# EAGLE design kurauduino (EAGLE 7.2.0)
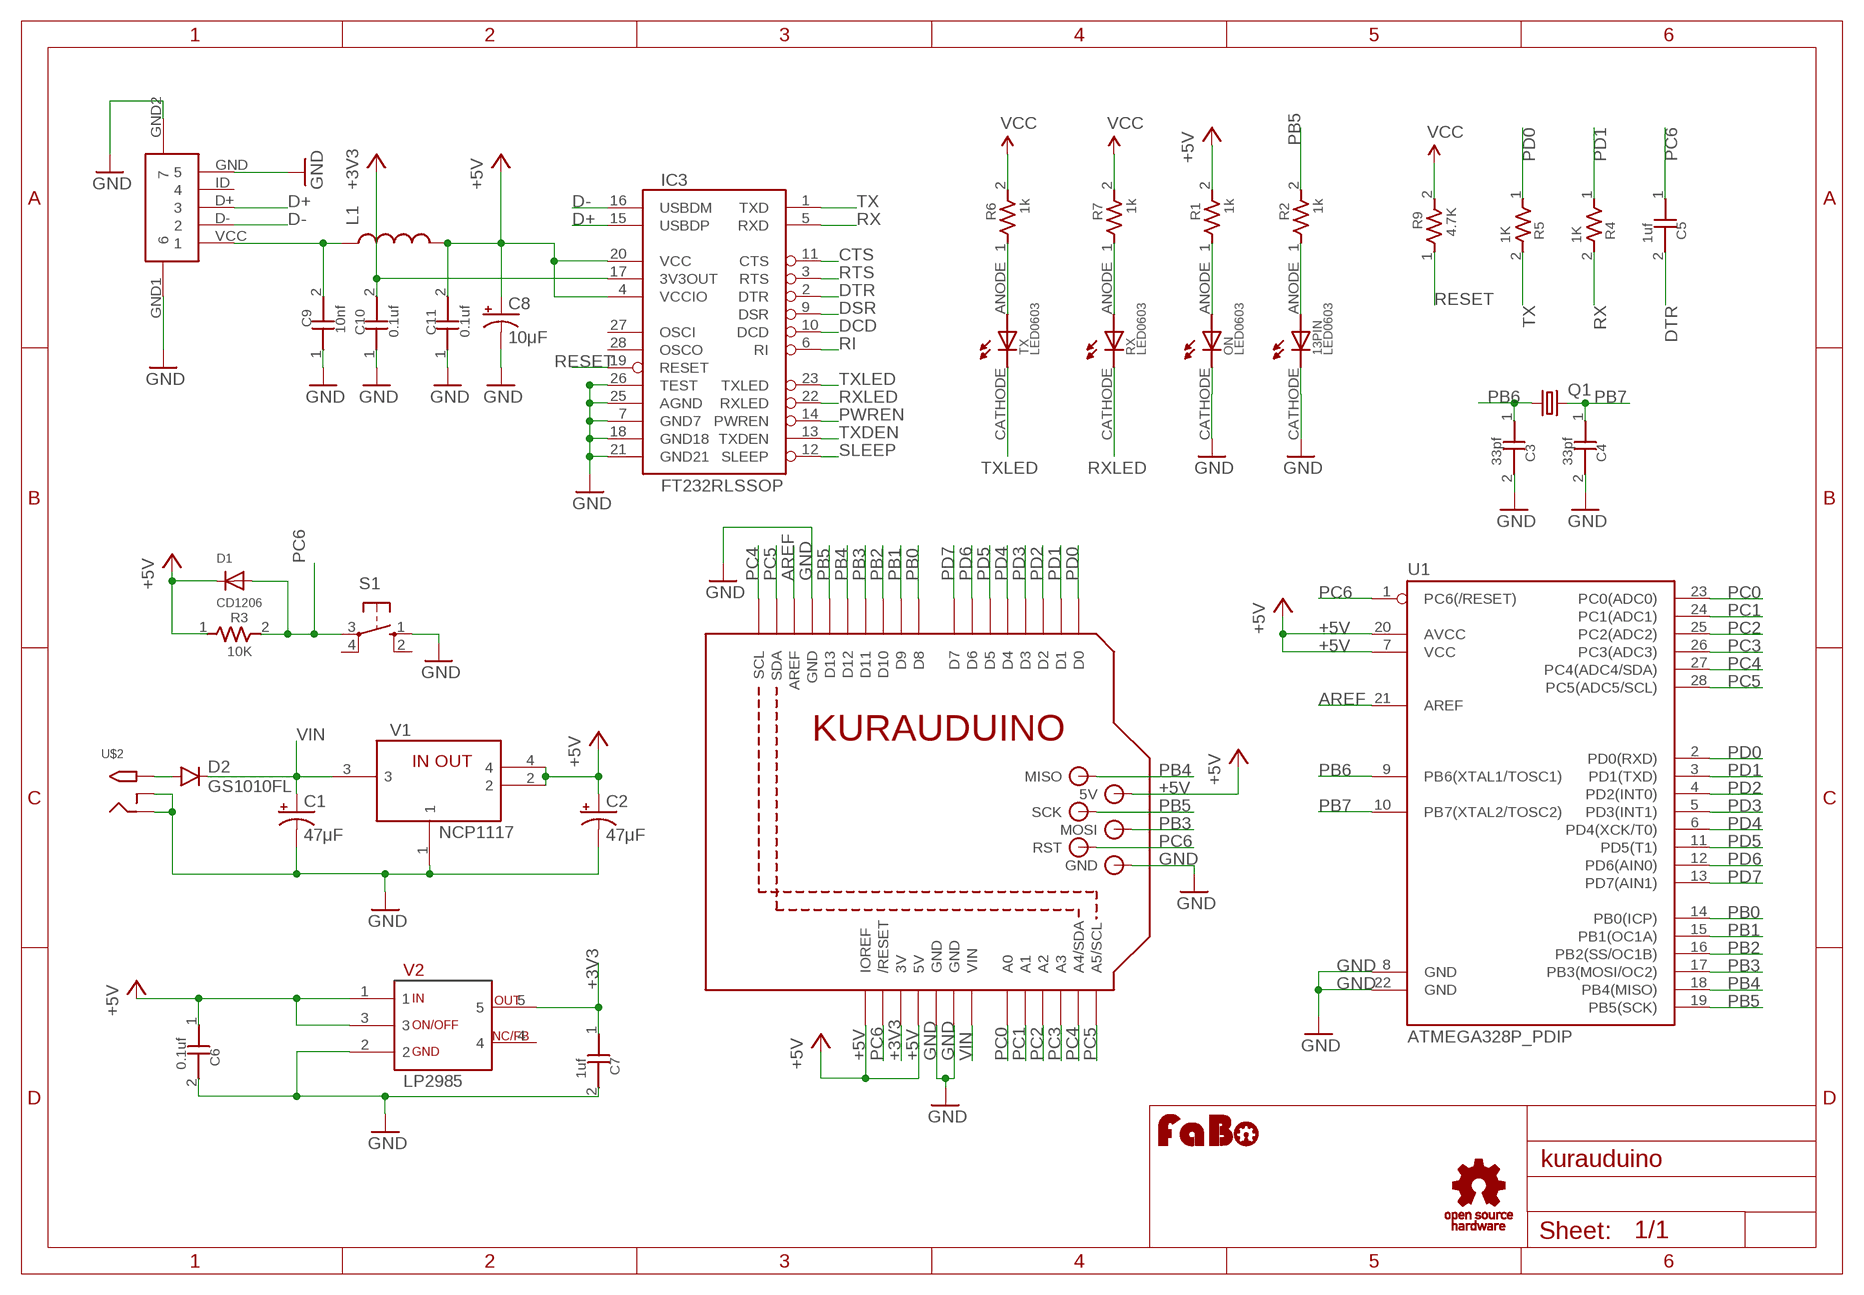
[diagram p0: schematic, sheet 1]

## Parts
13PIN  LED0603  [0603]
C1  47μF  CPOL-USD  [PANASONIC_D]
C2  47μF  CPOL-USD  [PANASONIC_D]
C3  33pf  CAPACITOR0603  [0603]
C4  33pf  CAPACITOR0603  [0603]
C5  1uf  CAPACITOR0603  [0603]
C6  0.1uf  CAPACITOR0603  [0603]
C7  1uf  CAPACITOR0603  [0603]
C8  10μF  CAP_POL1206  [EIA3216]
C9  10nf  CAPACITOR0603  [0603]
C10  0.1uf  CAPACITOR0603  [0603]
C11  0.1uf  CAPACITOR0603  [0603]
D1  CD1206  [CD1206]
D2  GS1010FL  DIODESOD123  [SOD-123]
IC3  FT232RLSSOP  [SSOP28DB]
L1  INDUCTOR0603  [0603]
ON  LED0603  [0603]
Q1  CRYSTALHC49S  [HC49/S]
R1  1k  RESISTOR0603  [0603]
R2  1k  RESISTOR0603  [0603]
R3  10K  RESISTOR0603  [0603]
R4  1K  RESISTOR0603  [0603]
R5  1K  RESISTOR0603  [0603]
R6  1k  RESISTOR0603  [0603]
R7  1k  RESISTOR0603  [0603]
R9  4.7K  RESISTOR0603  [0603]
RX  LED0603  [0603]
S1  10-XX  [B3F-10XX]
TX  LED0603  [0603]
U1  ATMEGA328P_PDIP  [DIL28-3]
U$1  KURAUDUINO  [KURAUDUINO]
U$2  2.1MMJACKTHM  [PJ-102A]
U$3  USB-MICRO-B-FEMALE  [USB-MICRO-B-FEMALE]
U$4  LOGO_FABO-M  [LOGO_FABO_M]
U$5  LOGO_OSHW_T-S  [LOGO_OSHW_T_S]
V1  NCP1117  [NCP1117]
V2  LP2985  [LP2985]

## Nets
+3V3 [power2]: C7.1 C10.2 IC3.17(3V3OUT) U$1.3V V2.5
+5V [power2]: C2.+ C6.1 C8.A(+) C11.2 D1.K IC3.4(VCCIO) IC3.20(VCC) L1.2 R1.2 R3.1 U1.7(VCC) U1.20(AVCC) U$1.5V U$1.5V_ICSP(5V) U$1.IOREF V1.2 V1.4 V2.1 V2.3
AREF [aref]: U1.21(AREF) U$1.AREF
CTS: IC3.11(CTS)
D+: IC3.15(USBDP) U$3.D+
D-: IC3.16(USBDM) U$3.D-
DCD: IC3.10(DCD)
DSR: IC3.9(DSR)
DTR: C5.2 IC3.2(DTR)
GND [gnd]: C1.- C2.- C3.2 C4.2 C6.2 C7.2 C8.C(-) C9.1 C10.1 C11.1 IC3.7(GND7) IC3.18(GND18) IC3.21(GND21) IC3.25(AGND) IC3.26(TEST) S1.1(S) U1.8(GND) U1.22(GND) U$1.GND U$1.GND1(GND) U$1.GND2(GND) U$1.GND@3(GND) U$2.RING U$2.RING_SW U$3.GND U$3.GND1 U$3.GND2 V1.1 V2.2
N$1 [power]: D2.A U$2.TIP
N$2: C9.2 L1.1 U$3.VCC
N$3: R6.1 TX.ANODE
N$4: ON.CATHODE
N$5: 13PIN.CATHODE
N$6: R7.1 RX.ANODE
N$7 [power2]: ON.ANODE R1.1
N$8: 13PIN.ANODE R2.1
PB0: U1.14(PB0(ICP)) U$1.D8
PB1: U1.15(PB1(OC1A)) U$1.D9
PB2: U1.16(PB2(SS/OC1B)) U$1.D10
PB3: U1.17(PB3(MOSI/OC2)) U$1.D11 U$1.MOSI
PB4: U1.18(PB4(MISO)) U$1.D12 U$1.MISO
PB5: R2.2 U1.19(PB5(SCK)) U$1.D13 U$1.SCK
PB6: C3.1 Q1.1 U1.9(PB6(XTAL1/TOSC1))
PB7: C4.1 Q1.2 U1.10(PB7(XTAL2/TOSC2))
PC0: U1.23(PC0(ADC0)) U$1.A0
PC1: U1.24(PC1(ADC1)) U$1.A1
PC2: U1.25(PC2(ADC2)) U$1.A2
PC3: U1.26(PC3(ADC3)) U$1.A3
PC4: U1.27(PC4(ADC4/SDA)) U$1.A4(A4/SDA) U$1.SCL
PC5: U1.28(PC5(ADC5/SCL)) U$1.A5(A5/SCL) U$1.SDA
PC6: C5.1 D1.A R3.2 S1.3(P) U1.1(PC6(/RESET)) U$1.RESET(/RESET) U$1.RESET_ICSP(RST)
PD0: R5.1 U1.2(PD0(RXD)) U$1.D0
PD1: R4.1 U1.3(PD1(TXD)) U$1.D1
PD2: U1.4(PD2(INT0)) U$1.D2
PD3: U1.5(PD3(INT1)) U$1.D3
PD4: U1.6(PD4(XCK/T0)) U$1.D4
PD5: U1.11(PD5(T1)) U$1.D5
PD6: U1.12(PD6(AIN0)) U$1.D6
PD7: U1.13(PD7(AIN1)) U$1.D7
PWREN: IC3.14(PWREN)
RESET: IC3.19(RESET) R9.1
RI: IC3.6(RI)
RTS: IC3.3(RTS)
RX: IC3.5(RXD) R4.2
RXLED: IC3.22(RXLED) RX.CATHODE
SLEEP: IC3.12(SLEEP)
TX: IC3.1(TXD) R5.2
TXDEN: IC3.13(TXDEN)
TXLED: IC3.23(TXLED) TX.CATHODE
VCC [usbvcc]: R6.2 R7.2 R9.2
VIN [power]: C1.+ D2.C U$1.VIN V1.3
Unconnected: IC3.27(OSCI) IC3.28(OSCO) S1.2(S1) S1.4(P1) U$3.ID V2.4

## Library data of the parts
13PIN ON RX TX = GClue-LED:LED
C1 C2 = adafruit:CPOL-US: POLARIZED CAPACITOR, American symbol
C3-C7 C9-C11 = GClue-Capacitor:CAPACITOR
C8 = SparkFun:CAP_POL: Capacitor Polarized These are standard SMD and PTH capacitors. Normally 10uF, 47uF, and 100uF in electrolytic and tantalum varieties. Always verify the external diameter of the through hole cap, it varies with capacity, voltage, and manufacturer. The EIA devices should be standard.
D1 = mylib:CD1206
D2 = SparkFun-DiscreteSemi:DIODE: Diode These are standard reverse protection diodes and small signal diodes. SMA package can handle up to about 1A. SOD-323 can handle about 200mA. What the SOD-323 package when ordering, there are some mfgs out there that are 5-pin packages.
IC3 = SparkFun:FT232RL: USB UART FT232RL 4th Generation USB UART (USB <-> Serial) Controller. Spark Fun Electronics SKU : COM-00650
L1 = SparkFun:INDUCTOR: Inductors Basic Inductor/Choke - 0603 and 1206. Footprints are not proven and vary greatly between part numbers.
Q1 = adafruit:CRYSTAL: CRYSTAL; OC_FARNELL: 1667008; OC_NEWARK: unknown
R1-R7 R9 = GClue-Resistors:RESISTOR
S1 = switch-omron:10-XX: OMRON SWITCH; MPN: B3F-1000; OC_FARNELL: 176432; OC_NEWARK: 36M3542
U1 = SparkFun-DigitalIC:ATMEGA328P_PDIP: uC used in the Arduino 32kb flash, 1k EEPROM, 2k SRAM This is the through-hole version of this chip.
U$1 = GClue-Board:KURAUDUINO
U$2 = adafruit:2.1MMJACK: 2.1mm x 5.5mm THM DC jack with internal switch. Digikey part #PJ-102A, 4UCON part #05537 2.1mm x 5.5mm SMT DC jack with internal switch. Digikey part #PJ-002A-SMT, 4UCON part #03267 By microbuilder.eu & adafruit.com
U$3 = gclue:USB-MICRO-B-FEMALE
U$4 = FaBo:LOGO_FABO
U$5 = gclue:LOGO_OSHW_T
V1 = mylib:NCP1117
V2 = mylib:LP2985

## Net classes
0 default: width 0.254 mm
1 power: width 0.61 mm
2 gnd: width 0.305 mm
3 usbvcc: width 0.508 mm
4 aref: width 0.406 mm
5 power2: width 0.508 mm

## Board
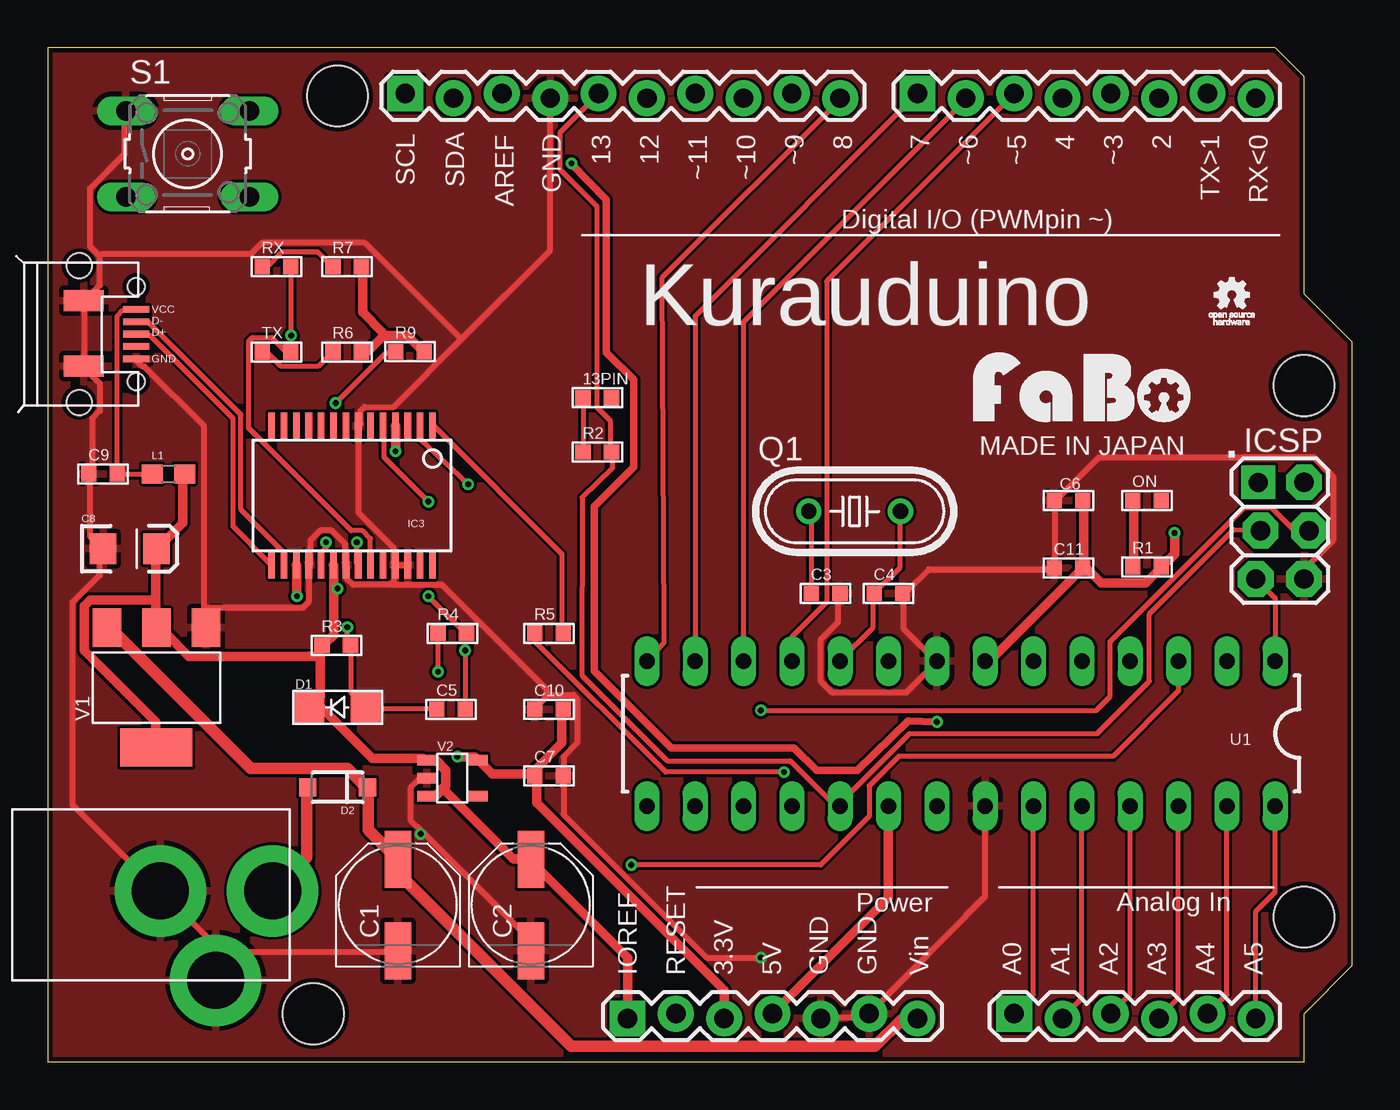
[diagram p1: board, top side]
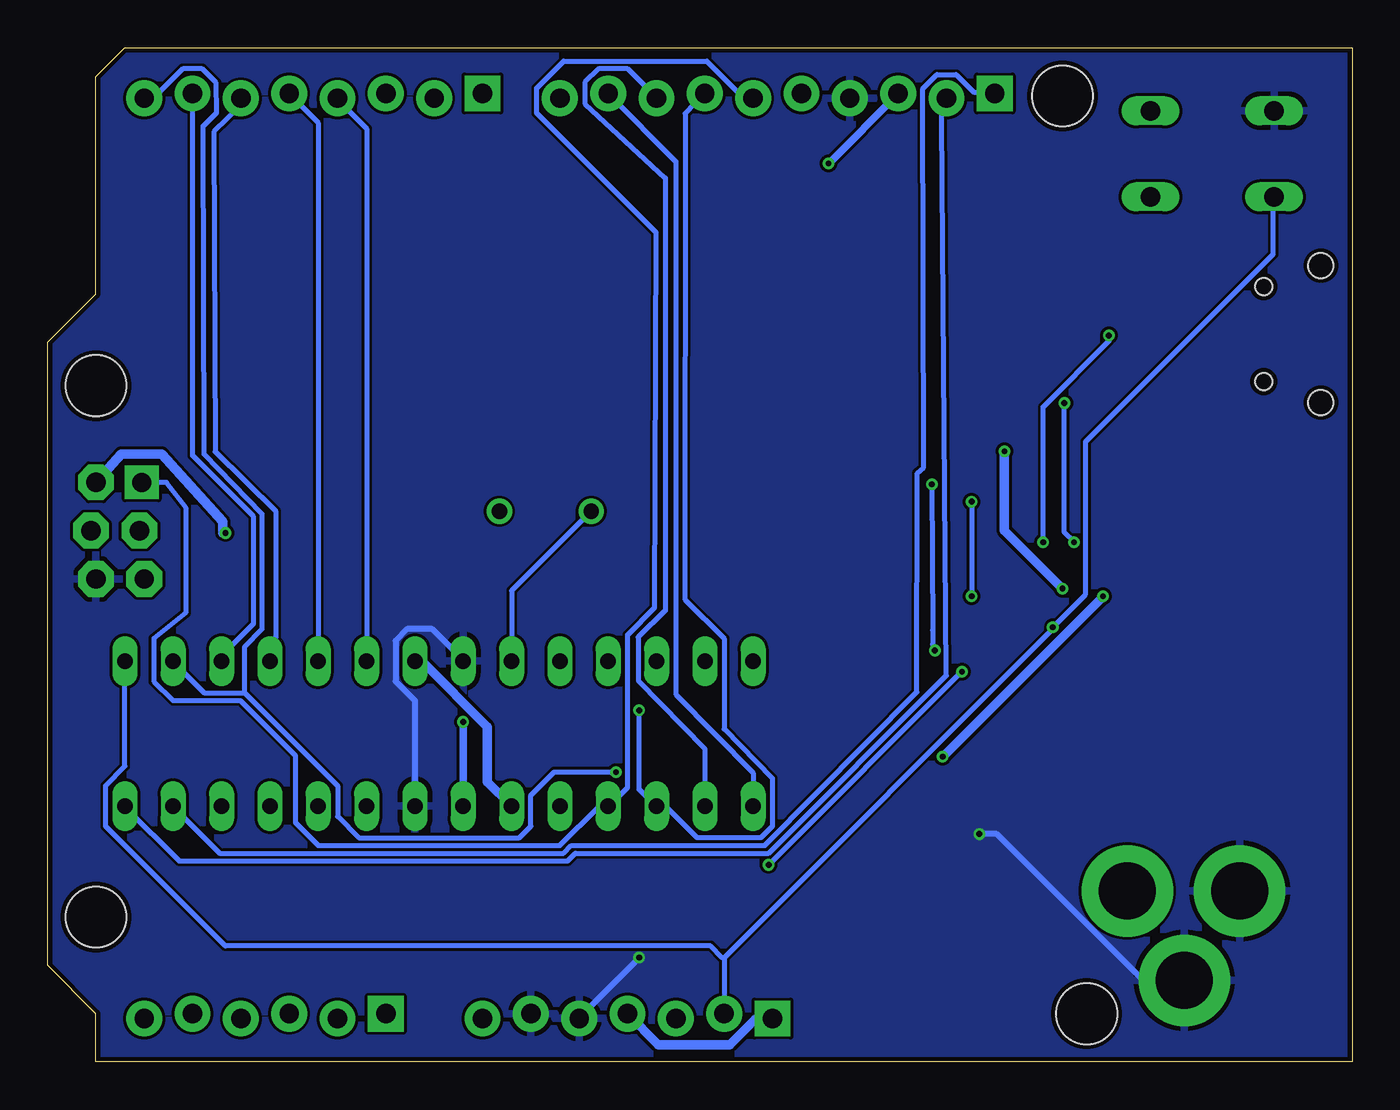
[diagram p2: board, bottom side, seen from below]

Size 68.58 x 53.34 mm. Coordinates in mm from the lower left corner, seen from the top.
Copper layers (1*16): Top 0.035mm / dielectric 1.5mm / Bottom 0.035mm
Design rules "Elecrow_2-layer_eagle_rule": minimum track width 6mil, minimum drill 12mil, track to track 6mil, track to pad 6mil, pad to pad 6mil, via to via 6mil, smd to smd 0mil, copper to edge 10mil, drill to drill 10mil, minimum pad ring 10mil, minimum via ring 6mil, stop-mask expansion 2mil, vias tented up to drill 100mil, thermal gap 10mil

### Footprints (pad centres in the part's own frame; a part is rotated, then mirrored left to right if it is on the bottom)
0603 = smd 0.8 x 0.8: ANODE -0.75,0; CATHODE 0.75,0
PANASONIC_D = smd 3 x 1.4: + 2.4,0; - -2.4,0
0603' = smd 0.8 x 0.8: 1 -0.75,0; 2 0.75,0
EIA3216 = smd 1.4 x 1.6: A 1.4,0; C -1.4,0
CD1206 = smd 1.6 x 1.6: A 1.5,0; K -1.5,0
SOD-123 = smd 0.9 x 0.95: A 1.575,0; C -1.575,0
SSOP28DB = smd 0.348 x 1.397: 1 -4.225,-3.656; 2 -3.575,-3.656; 3 -2.925,-3.656; 4 -2.275,-3.656; 5 -1.625,-3.656; 6 -0.975,-3.656; 7 -0.325,-3.656; 8 0.325,-3.656; 9 0.975,-3.656; 10 1.625,-3.656; 11 2.275,-3.656; 12 2.925,-3.656; 13 3.575,-3.656; 14 4.225,-3.656; 15 4.225,3.656; 16 3.575,3.656; 17 2.925,3.656; 18 2.275,3.656; 19 1.625,3.656; 20 0.975,3.656; 21 0.325,3.656; 22 -0.325,3.656; 23 -0.975,3.656; 24 -1.625,3.656; 25 -2.275,3.656; 26 -2.925,3.656; 27 -3.575,3.656; 28 -4.225,3.656
0603'' = smd 1.1 x 1: 1 -0.85,0; 2 0.85,0
HC49/S = drill 0.813: 1 -2.413,0; 2 2.413,0
B3F-10XX = drill 1.016 long: 1 -3.251,2.261; 2 3.251,2.261; 3 -3.251,-2.261; 4 3.251,-2.261
DIL28-3 = drill 0.813 long: 1 -16.51,-3.81; 2 -13.97,-3.81; 3 -11.43,-3.81; 4 -8.89,-3.81; 5 -6.35,-3.81; 6 -3.81,-3.81; 7 -1.27,-3.81; 8 1.27,-3.81; 9 3.81,-3.81; 10 6.35,-3.81; 11 8.89,-3.81; 12 11.43,-3.81; 13 13.97,-3.81; 14 16.51,-3.81; 15 16.51,3.81; 16 13.97,3.81; 17 11.43,3.81; 18 8.89,3.81; 19 6.35,3.81; 20 3.81,3.81; 21 1.27,3.81; 22 -1.27,3.81; 23 -3.81,3.81; 24 -6.35,3.81; 25 -8.89,3.81; 26 -11.43,3.81; 27 -13.97,3.81; 28 -16.51,3.81
KURAUDUINO = drill 1.016 pad 1.88: 3V 35.56,2.286; 5V 38.1,2.54; A1 53.34,2.286; A2 55.88,2.54; A3 58.42,2.286; A4 60.96,2.54; A5 63.5,2.286; AREF 23.876,50.927; D0 63.5,50.673; D1 60.96,50.927; D2 58.42,50.673; D3 55.88,50.927; D4 53.34,50.673; D5 50.8,50.927; D6 48.26,50.673; D8 41.656,50.673; D9 39.116,50.927; D10 36.576,50.673; D11 34.036,50.927; D12 31.496,50.673; D13 28.956,50.927; GND 26.416,50.673; GND1 43.18,2.54; GND2 40.64,2.286; RESET 33.02,2.54; SDA 21.336,50.673; VIN 45.72,2.286 | drill 1.016 pad 1.88 octagon: 5V_ICSP 66.04,30.48; GND@3 66.04,25.4; MOSI 66.294,27.94; RESET_ICSP 63.5,25.4; SCK 63.754,27.94 | drill 1.016 pad 1.88 square: A0 50.8,2.54; D7 45.72,50.927; IOREF 30.48,2.286; SCL 18.796,50.927 | drill 1 pad 1.778 square: MISO 63.627,30.48 | hole 3.2: 15.24,50.8; 66.04,35.56; 13.97,2.54; 66.04,7.62
PJ-102A = drill 3 pad 4.8: RING 0.1,-3.39; RING_SW -4.6,-6.29; TIP 0.1,-9.29
USB-MICRO-B-FEMALE = smd 1.35 x 0.35: D+ 3,0; D- 3,0.65; GND 3,-1.3; ID 3,-0.65; VCC 3,1.3 | smd 2.1 x 1.1: GND1 0.246,1.77; GND2 0.246,-1.67 | hole 1.3: 0,3.6; 0,-3.6 | hole 0.9: 3,2.5; 3,-2.5
NCP1117 = smd 2 x 1.5: 1 3.15,-2.6; 2 3.15,0; 3 3.15,2.6 | smd 2 x 3.8: 4 -3.15,0
LP2985 = smd 1 x 0.55: 1 -1.35,0.95; 2 -1.35,0; 3 -1.35,-0.95; 4 1.35,-0.95; 5 1.35,0.95

### Placement (x,y rotation side)
13PIN  28.89,34.92 0 top
C1  18.41,8.26 90 top
C2  25.4,8.26 90 top
C3  33pf  [0603']  40.89,24.64 0 top
C4  33pf  [0603']  44.2,24.64 0 top
C5  1uf  [0603']  21.21,18.54 0 top
C6  0.1uf  [0603']  53.66,29.53 180 top
C7  1uf  [0603']  26.35,15.05 0 top
C8  4.32,26.99 0 top
C9  10nf  [0603']  2.92,30.92 0 top
C10  0.1uf  [0603']  26.35,18.54 0 top
C11  0.1uf  [0603']  53.66,25.97 0 top
D1  15.24,18.65 0 top
D2  15.24,14.45 180 top
IC3  16,29.78 180 top
L1  [0603'']  6.35,30.92 0 top
ON  57.78,29.53 0 top
Q1  42.42,28.96 0 top
R1  1k  [0603']  57.78,26.04 0 top
R2  1k  [0603']  28.89,32.07 0 top
R3  10K  [0603']  15.18,21.91 0 top
R4  1K  [0603']  21.27,22.54 0 top
R5  1K  [0603']  26.35,22.54 0 top
R6  1k  [0603']  15.75,37.34 0 top
R7  1k  [0603']  15.75,41.81 0 top
R9  4.7K  [0603']  19.04,37.36 0 top
RX  12.03,41.81 0 top
S1  7.37,47.75 0 top
TX  12.03,37.34 0 top
U1  48.01,17.27 180 top
U$1  0,0 0 top
U$2  2.54,8.89 90 top
U$3  1.66,38.27 0 top
U$4  54.37,33.66 0 top
U$5  62.23,40.32 0 top
V1  5.71,19.68 90 top
V2  21.27,14.92 0 top

### Tracks (layer width: path | path; a pad name or v marks a point on that pad's centre or on a via)
+3V3  (via drill 0.3)
  Top 0.508: C7.1 25.5,15.14 23.37,15.14 22.66,15.85 V2.5 22.45,16.05 v21.54,16.05 | C10.2 27.03,18.49 27.03,16.76 25.6,15.34 C7.1 | v13.11,24.49 13.11,26.11 IC3.17 | U$1.3V 35.56,3.76 25.7,13.61 25.7,14.83 C7.1
  Bottom 0.508: v21.54,16.05 v13.11,24.49
+5V  (via drill 0.3)
  Top 0.508: C11.2 54.46,26.01 54.46,29.46 C6.1 | C11.2 54.66,25.91 55.37,25.2 57.71,25.2 58.52,26.01 R1.2 58.73,26.21 59.23,26.72 v59.23,27.81 | C11.2 54.25,25.81 49.58,21.13 49.28,21.13 U1.7 | L1.2 7.11,30.89 7.11,28.35 5.79,27.03 C8.A 5.69,26.82 5.69,24.28 | 5.69,24.28 5.69,22.86 V1.2 5.89,22.66 6.1,22.66 7.42,21.34 14.33,21.34 | 5.69,24.28 2.23,24.28 1.93,23.98 1.93,21.64 5.69,17.88 5.69,16.56 V1.4 | 20.78,14.38 20.93,14.53 20.93,15.34 20.42,15.85 20.02,15.85 V2.1 19.71,15.95 17.07,15.95 14.22,18.8 D1.K 13.82,18.69 14.33,19.2 14.33,21.34 | 20.78,14.38 20.42,14.02 20.02,14.02 V2.3 | 20.78,14.38 24.49,10.67 C2.+ 25.5,10.46 30.48,5.49 U$1.IOREF | 14.33,21.34 14.33,21.84 R3.1 14.63,22.05 15.04,22.45 15.04,24.89 | 15.04,24.89 15.04,26.11 IC3.20 | v18.29,32.11 18.29,33.43 IC3.4 | v15.24,24.89 15.04,24.89 | U1.20 44.2,8.64 U$1.5V
  Bottom 0.508: U1.20 45.48,14.73 45.48,14.92 45.47,17.63 48.87,21.03 49.28,21.03 U1.7 | U$1.5V_ICSP 64.72,31.96 62.59,31.96 59.37,28.42 59.37,27.81 v59.23,27.81 | U$1.5V 36.47,0.91 32.72,0.91 31.39,2.23 30.48,2.23 U$1.IOREF | v18.29,32.11 18.29,27.94 v15.24,24.89
AREF  (via drill 0.3)
  Top 0.406: v46.74,17.88 45.24,17.94 42.55,15.34 40.44,15.34 39.22,16.51 32.77,16.51 28.73,20.55 28.73,29.21 30.8,31.27 30.8,35.88 29.37,37.31 29.37,45.34 v27.53,47.24
  Bottom 0.406: v46.74,17.88 U1.21 | v27.53,47.24 23.88,50.9 U$1.AREF
D+
  Top 0.254: U$3.D+ 4.67,38.2 5.38,38.2 9.75,33.83 9.75,28.14 11.68,26.21 IC3.15
D-
  Top 0.254: U$3.D- 4.67,38.91 5.28,38.91 10.16,34.04 10.16,29.06 12.39,26.82 12.39,26.21 IC3.16
DTR  (via drill 0.3)
  Top 0.254: v21.95,21.64 21.95,18.59 C5.2 | v22.1,30.38 19.61,32.72 19.61,33.43 IC3.2
  Bottom 0.254: v22.1,30.38 22.07,22.7 22.07,21.96 v21.95,21.64
GND  (via drill 0.3)
  Top 0.305: 2.74,42.37 2.23,42.88 2.23,45.92 4.06,47.75 4.06,49.99 S1.1 | 2.74,42.37 2.74,40.84 2.03,40.13 U$3.GND1 1.93,40.03 1.93,36.68 U$3.GND2 1.93,36.47 2.74,35.66 2.74,34.24 2.34,33.83 2.34,30.99 C9.1 2.23,30.89 2.23,27.64 2.85,27.03 C8.C 2.74,26.92 2.74,25.6 1.32,24.18 1.32,13.51 5.79,9.04 U$2.RING 5.99,8.94 9.65,5.28 U$2.RING_SW 8.84,4.37 10.26,5.79 18.39,5.79 C1.- | 19.71,12.09 25.4,6.4 C2.- | 19.71,12.09 19.1,12.7 19.1,14.43 19.51,14.83 19.91,14.83 V2.2 | v19.61,11.99 19.71,12.09 | U1.22 49.28,8.71 U$1.GND1 42.98,2.34 40.64,2.34 U$1.GND2 | C3.2 41.55,24.59 41.55,23.14 40.64,22.23 40.64,20.02 41.25,19.41 45.11,19.41 46.74,21.03 U1.8 46.63,21.13 45.01,22.76 45.01,24.59 C4.2 45.11,24.69 46.33,25.91 52.83,25.91 C11.1 52.93,26.01 52.93,29.46 C6.2 53.03,29.57 55.27,31.8 66.55,31.8 67.56,30.79 67.56,27.43 66.04,25.91 U$1.GND@3 | 8.23,23.88 8.23,22.86 V1.1 | 8.23,23.88 8.23,33.43 5.08,36.58 4.98,36.58 4.67,36.88 U$3.GND | 26.31,19.3 27.64,19.3 27.84,19.1 27.84,16.76 27.13,16.05 27.13,15.14 C7.2 27.13,14.94 27.13,13.01 34.65,5.49 v37.49,5.49 | 26.31,19.3 25.6,18.59 C10.1 | IC3.25 18.29,26.11 18.9,26.11 IC3.26 | IC3.25 18.19,26.21 18.19,27.03 16.36,28.85 16.36,33.43 IC3.7 16.46,33.53 16.46,34.24 16.66,34.44 18.19,34.44 21.74,38 | 18.09,25.2 18.19,25.3 18.19,26.01 IC3.25 | 18.09,25.2 17.98,25.09 16.05,25.09 15.75,25.4 15.75,26.01 IC3.21 15.65,26.21 15.65,27.23 14.94,27.94 14.33,27.94 13.82,27.43 13.82,26.21 IC3.18 13.72,26.01 13.72,24.18 13.41,23.88 8.23,23.88 | 26.31,19.3 26.21,19.41 26.21,19.61 20.73,25.09 18.19,25.09 18.09,25.2 | U$1.GND 26.42,42.67 21.74,38
  Top 0.305: 21.74,38 16.66,43.08 11.28,43.08 10.67,42.47 2.85,42.47 2.74,42.37
  Bottom 0.305: v19.61,11.99 18.69,11.99 11.07,4.37 8.84,4.37 U$2.RING_SW | U1.22 49.28,19 50.29,20.02 50.29,22.15 49.68,22.76 48.36,22.76 46.74,21.13 U1.8 | v37.49,5.49 40.64,2.34 U$1.GND2
  pour Top: -1.27,54.61 69.85,54.61 69.85,-1.27 -1.27,-1.27
  pour Bottom: -1.27,54.61 69.85,54.61 69.85,-1.27 -1.27,-1.27
N$1
  Top 0.61: D2.A 13.61,14.43 13.61,10.77 11.89,9.04 U$2.TIP
N$2
  Top 0.254: L1.1 5.49,30.89 3.76,30.89 C9.2 3.66,30.99 3.66,39.22 3.96,39.52 4.57,39.52 U$3.VCC
N$3
  Top 0.254: TX.ANODE 11.38,37.29 11.58,37.29 12.29,36.58 14.22,36.58 14.94,37.29 R6.1
N$6
  Top 0.254: RX.ANODE 11.38,41.86 11.58,41.86 12.29,42.57 14.22,42.57 14.94,41.86 R7.1
N$7
  Top 0.508: R1.1 57.1,26.11 57.1,29.46 ON.ANODE
N$8
  Top 0.254: R2.1 28.14,32.11 28.14,34.85 13PIN.ANODE
PB0
  Top 0.254: U1.14 32.38,22.04 32.38,22.86 32.29,41.23 41.66,50.6 U$1.D8
PB1
  Bottom 0.254: U1.15 31.5,15.19 35.56,19.33 35.56,47.35 39.12,50.9 U$1.D9
PB2
  Bottom 0.254: U1.16 34.04,16.46 37.53,20.04 37.54,22.34 36.12,23.73 36.11,46.48 40.34,50.39 40.34,51.51 39.62,52.22 38.1,52.22 36.58,50.7 U$1.D10
PB3  (via drill 0.3)
  Top 0.254: U$1.MOSI 65.53,27.94 64.31,29.16 62.89,29.16 55.85,22.12 55.85,19.22 55.12,18.49 v37.49,18.49
  Bottom 0.254: U$1.D11 35.07,49.87 35.08,24.33 33.02,22.26 33.02,17.5 30.48,14.92 30.48,12.39 31.09,11.79 34.44,11.79 36.07,13.41 36.58,13.41 U1.17 36.68,13.51 37.49,14.33 v37.49,18.49
PB4
  Bottom 0.254: U$1.MISO 62.33,30.48 61.33,29.16 61.33,23.62 62.99,22.28 62.99,20.02 61.98,19 58.45,19 55.56,16.12 55.56,12.59 54.36,11.38 41.66,11.38 39.62,13.41 39.12,13.41 U1.18 39.01,13.51 38.1,14.43 38.1,22.46 36.67,23.89 36.59,43.61 42.88,49.89 42.88,51.21 41.45,52.63 33.93,52.63 32,50.7 31.5,50.7 U$1.D12
PB5
  Top 0.254: U$1.D13 28.96,50.9 26.92,48.87 26.92,46.94 28.85,45.01 28.85,34.44 29.57,33.73 29.57,32.11 R2.2 29.67,32 29.69,31.21 28.1,29.69 28.08,20.33 32.57,15.84 39.02,15.84 41.35,13.51 41.66,13.51 U1.19 41.66,13.61 45.31,17.27 55.17,17.27 57.91,20.02 57.91,23.55 62.35,27.99 63.7,27.94 U$1.SCK
PB6
  Top 0.254: C3.1 40.13,24.69 40.13,28.85 40.03,28.96 Q1.1
  Bottom 0.254: U1.9 44.2,24.79 40.03,28.96 Q1.1
PB7
  Top 0.254: U1.10 41.66,21.13 43.38,22.86 43.38,24.59 C4.1 43.48,24.69 44.81,26.01 44.81,28.96 Q1.2
PC0
  Top 0.254: U1.23 51.82,3.56 U$1.A0
PC1
  Top 0.254: U1.24 54.36,3.35 53.34,2.34 U$1.A1
PC2
  Top 0.254: U1.25 56.9,3.56 U$1.A2
PC3
  Top 0.254: U1.26 59.44,3.35 58.42,2.34 U$1.A3
PC4
  Top 0.254: U1.27 61.98,3.56 U$1.A4
  Bottom 0.254: U$1.SCL 18.8,51 19.91,51 20.83,51.92 21.84,51.92 22.58,51.18 22.54,31.26 22.86,30.96 22.89,19.45 30.89,11.38 41.05,11.38 41.45,10.97 59.54,10.97 61.98,13.41 U1.27
PC5
  Top 0.254: U1.28 64.52,8.94 63.5,7.92 U$1.A5
  Bottom 0.254: U$1.SDA 21.59,50.67 21.59,49.53 21.34,20.32 30.68,10.97 40.84,10.97 41.25,10.57 61.67,10.57 64.52,13.41 U1.28
PC6  (via drill 0.3)
  Top 0.254: U1.1 64.52,24.38 U$1.RESET_ICSP | C5.1 20.42,18.59 16.76,18.59 D1.A 16.66,18.69 15.95,19.41 15.95,21.84 R3.2 15.85,21.95 15.75,22.05 v15.75,22.86
  Bottom 0.254: S1.3 4.17,45.41 4.17,42.47 14.02,32.61 14.02,24.59 v15.75,22.86 15.75,22.76 33.02,5.49 | 33.02,5.49 U$1.RESET | U1.1 64.52,15.54 65.53,14.53 65.53,12.39 59.23,6.1 33.73,6.1 33.12,5.49 33.02,5.49
PD0  (via drill 0.3)
  Top 0.254: v38.71,15.24 32.49,15.24 25.59,22.14 25.6,22.45 R5.1
  Bottom 0.254: v38.71,15.24 41.96,15.24 43.18,14.02 43.18,12.39 43.79,11.79 52.22,11.79 53.34,12.9 53.34,14.53 58.22,19.41 | 58.22,19.41 60.35,19.41 61.98,21.03 U1.2 | 58.22,19.41 58.22,21.81 57.31,22.77 57.31,28.81 60.35,31.97 60.4,49.21 59.69,49.9 59.72,51.49 60.45,52.22 61.47,52.22 62.99,50.7 63.5,50.7 U$1.D0
PD1  (via drill 0.3)
  Top 0.254: v20.52,20.52 20.52,22.45 R4.1 | v30.68,10.36 40.64,10.36 43.18,12.9 43.18,14.53 44.72,16.07 56.01,16.07 59.44,19.5 U1.3
  Bottom 0.254: v30.68,10.36 v20.52,20.52 | U$1.D1 60.96,31.88 57.75,28.67 57.75,23.06 59.44,21.37 U1.3
PD2
  Bottom 0.254: U1.4 56.59,22.35 56.59,28.97 59.77,32.09 59.83,48.91 58.42,50.28 U$1.D2
PD3
  Bottom 0.254: U1.5 54.36,49.38 55.88,50.9 U$1.D3
PD4
  Bottom 0.254: U1.6 51.82,49.07 53.34,50.6 U$1.D4
PD5
  Top 0.254: U1.11 39.12,22.35 40.95,24.18 40.95,41.05 50.8,50.9 U$1.D5
PD6
  Top 0.254: U1.12 36.58,38.91 48.26,50.6 U$1.D6
PD7
  Top 0.254: U1.13 34.04,39.22 45.72,50.9 U$1.D7
RESET  (via drill 0.3)
  Top 0.254: v15.14,34.65 17.78,37.29 18.29,37.29 R9.1 | v14.63,27.33 14.63,27.03 14.43,26.82 14.43,26.21 IC3.19
  Bottom 0.254: v15.14,34.65 15.14,27.84 v14.63,27.33
RX  (via drill 0.3)
  Top 0.254: v20.02,24.49 21.95,22.55 R4.2 | v20.02,29.46 17.68,31.8 17.68,33.43 IC3.5
  Bottom 0.254: v20.02,29.46 v20.02,24.49
RXLED  (via drill 0.3)
  Top 0.254: v12.8,38.2 12.8,41.76 RX.CATHODE | v16.26,27.33 16.26,26.21 IC3.22
  Bottom 0.254: v12.8,38.2 12.8,37.9 16.26,34.44 v16.26,27.33
TX
  Top 0.254: R5.2 27.03,22.55 27.03,26.72 20.32,33.43 IC3.1
TXLED
  Top 0.254: TX.CATHODE 12.7,37.39 12.5,37.39 11.79,38.1 10.77,38.1 10.57,37.9 10.57,33.33 15.95,27.94 16.56,27.94 16.97,27.53 16.97,26.21 IC3.23
VCC
  Top 0.508: 17.68,38.2 16.87,37.39 16.56,37.39 R6.2 | 17.68,38.2 18.9,38.2 19.71,37.39 R9.2 | R7.2 16.56,41.76 16.56,39.42 17.58,38.41 17.68,38.2
VIN
  Top 0.61: V1.3 3.15,22.76 3.35,22.76 10.67,15.44 15.75,15.44 16.56,14.63 D2.C 16.87,14.43 16.87,12.19 18.39,10.67 C1.+ 18.49,10.36 18.49,9.86 27.53,0.81 43.48,0.81 44.91,2.23 45.72,2.23 U$1.VIN

### Text on the board
tPlace: Kurauduino | MADE IN JAPAN